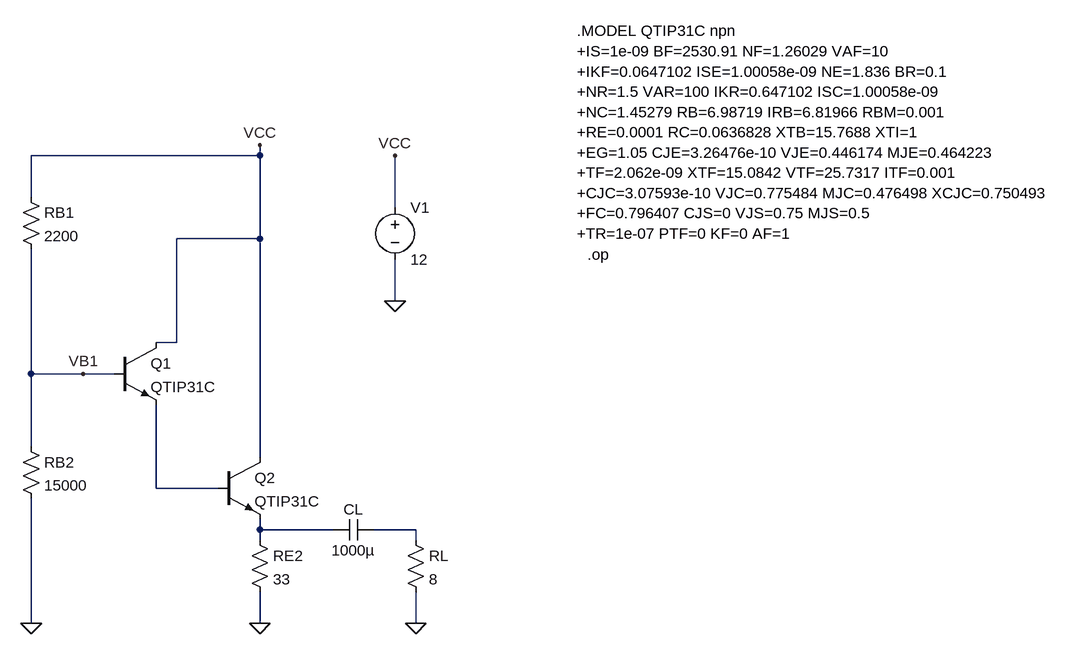
[diagram p0: schematic Darlington.asc]
Darlington.asc, the LTspice schematic file:
Version 4
SHEET 1 1048 696
WIRE -656 -432 -656 -448
WIRE -656 -432 -1008 -432
WIRE -1008 -368 -1008 -432
WIRE -448 -352 -448 -432
WIRE -656 -304 -656 -432
WIRE -656 -304 -784 -304
WIRE -448 -208 -448 -272
WIRE -784 -144 -784 -304
WIRE -784 -144 -816 -144
WIRE -1008 -96 -1008 -288
WIRE -928 -96 -1008 -96
WIRE -880 -96 -928 -96
WIRE -1008 16 -1008 -96
WIRE -656 32 -656 -304
WIRE -816 80 -816 -48
WIRE -720 80 -816 80
WIRE -656 144 -656 128
WIRE -544 144 -656 144
WIRE -416 144 -480 144
WIRE -656 160 -656 144
WIRE -416 160 -416 144
WIRE -1008 288 -1008 96
WIRE -656 288 -656 240
WIRE -416 288 -416 240
FLAG -656 -448 VCC
FLAG -1008 288 0
FLAG -448 -208 0
FLAG -448 -432 VCC
FLAG -928 -96 VB1
FLAG -656 288 0
FLAG -416 288 0
SYMBOL npn -880 -144 R0
SYMATTR InstName Q1
SYMATTR Value QTIP31C
SYMBOL npn -720 32 R0
SYMATTR InstName Q2
SYMATTR Value QTIP31C
SYMBOL res -1024 0 R0
SYMATTR InstName RB2
SYMATTR Value 15000
SYMBOL res -1024 -384 R0
SYMATTR InstName RB1
SYMATTR Value 2200
SYMBOL res -672 144 R0
SYMATTR InstName RE2
SYMATTR Value 33
SYMBOL voltage -448 -368 R0
WINDOW 123 0 0 Left 2
WINDOW 39 0 0 Left 2
SYMATTR InstName V1
SYMATTR Value 12
SYMBOL cap -480 128 R90
WINDOW 0 0 32 VBottom 2
WINDOW 3 32 32 VTop 2
SYMATTR InstName CL
SYMATTR Value 1000µ
SYMBOL res -432 144 R0
SYMATTR InstName RL
SYMATTR Value 8
TEXT -168 -624 Left 2 !.MODEL QTIP31C npn\n+IS=1e-09 BF=2530.91 NF=1.26029 VAF=10\n+IKF=0.0647102 ISE=1.00058e-09 NE=1.836 BR=0.1\n+NR=1.5 VAR=100 IKR=0.647102 ISC=1.00058e-09\n+NC=1.45279 RB=6.98719 IRB=6.81966 RBM=0.001\n+RE=0.0001 RC=0.0636828 XTB=15.7688 XTI=1\n+EG=1.05 CJE=3.26476e-10 VJE=0.446174 MJE=0.464223\n+TF=2.062e-09 XTF=15.0842 VTF=25.7317 ITF=0.001\n+CJC=3.07593e-10 VJC=0.775484 MJC=0.476498 XCJC=0.750493\n+FC=0.796407 CJS=0 VJS=0.75 MJS=0.5\n+TR=1e-07 PTF=0 KF=0 AF=1
TEXT -152 -280 Left 2 !.op

The netlist it stands for:
* Darlington.asc
Q1 VCC VB1 N001 0 QTIP31C
Q2 VCC N001 N002 0 QTIP31C
RB2 VB1 0 15000
RB1 VCC VB1 2200
RE2 N002 0 33
V1 VCC 0 12
CL N003 N002 1000µ
RL N003 0 8
.model NPN NPN
.model PNP PNP
.lib standard.bjt
.MODEL QTIP31C npn
+IS=1e-09 BF=2530.91 NF=1.26029 VAF=10
+IKF=0.0647102 ISE=1.00058e-09 NE=1.836 BR=0.1
+NR=1.5 VAR=100 IKR=0.647102 ISC=1.00058e-09
+NC=1.45279 RB=6.98719 IRB=6.81966 RBM=0.001
+RE=0.0001 RC=0.0636828 XTB=15.7688 XTI=1
+EG=1.05 CJE=3.26476e-10 VJE=0.446174 MJE=0.464223
+TF=2.062e-09 XTF=15.0842 VTF=25.7317 ITF=0.001
+CJC=3.07593e-10 VJC=0.775484 MJC=0.476498 XCJC=0.750493
+FC=0.796407 CJS=0 VJS=0.75 MJS=0.5
+TR=1e-07 PTF=0 KF=0 AF=1
.op
.backanno
.end